# EAGLE schematic ChessMechPCB2 (EAGLE 9.6.2)
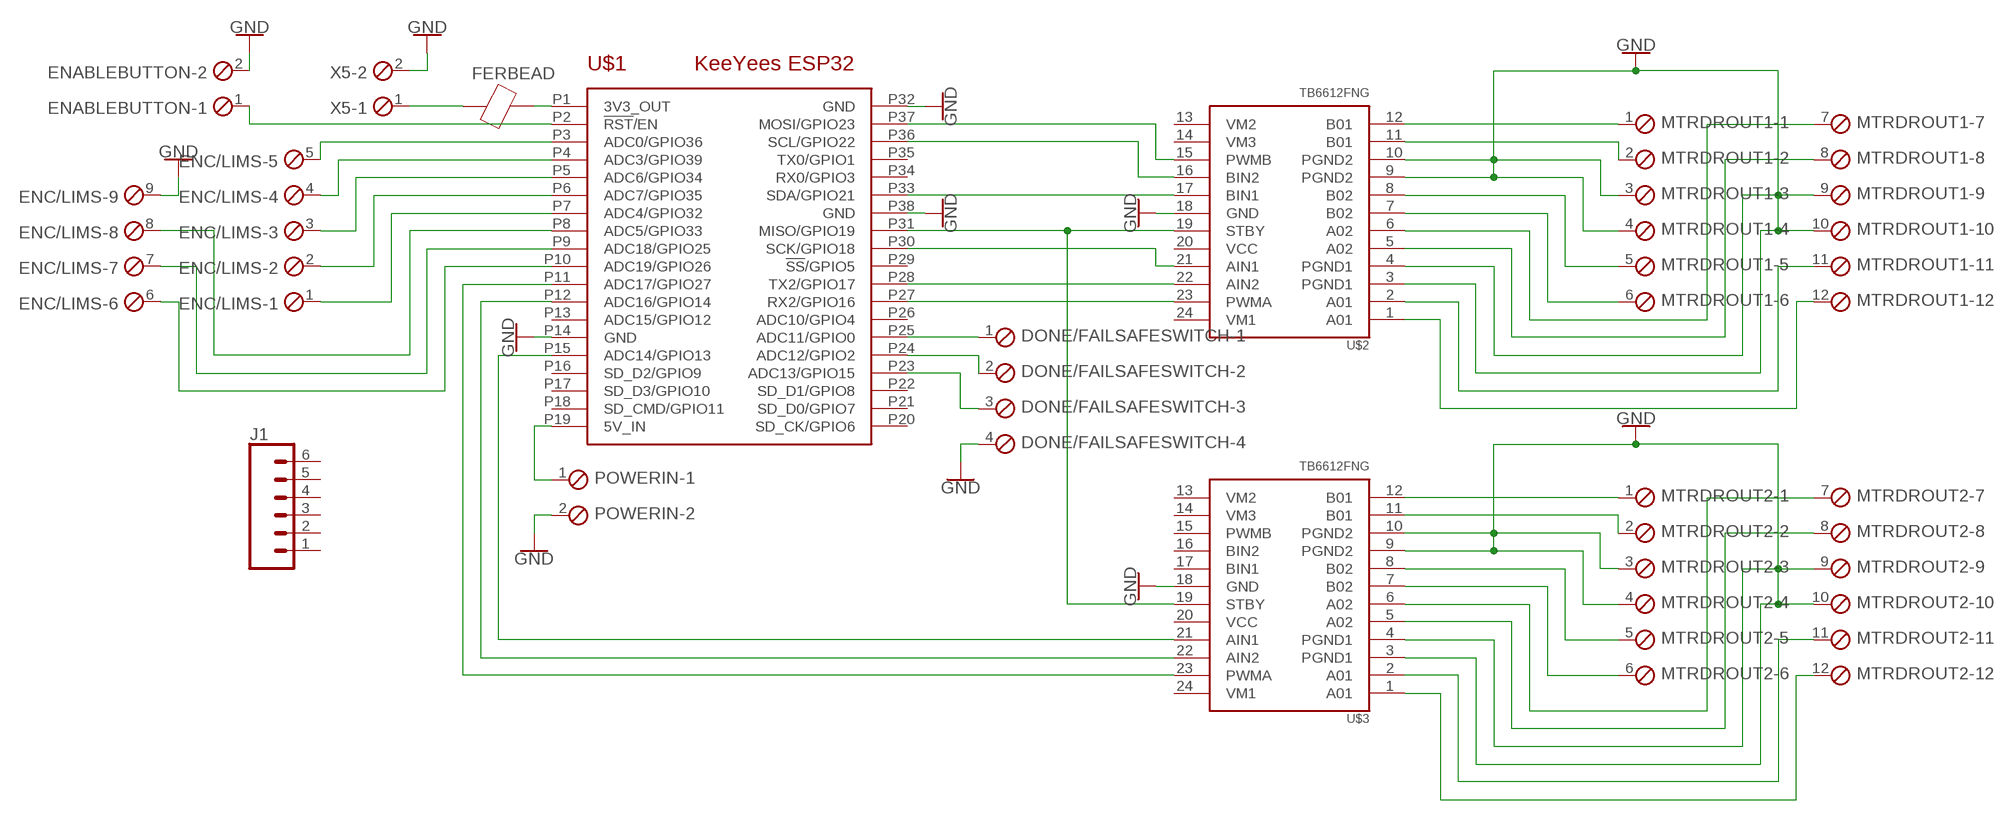
[diagram p0: schematic, sheet 1]

## Parts
DONE/FAILSAFESWITCH  SCREWTERM_4P_254  [4POL254]
ENABLEBUTTON  SCREWTERM_2P_254  [2POL254]
ENC/LIMS  SCREWTERM_9P_254  [9POL254]
FERBEAD  BEAD0402  [0402]
J1  CONN_06SILK_FEMALE_PTH  [1X06]
MTRDROUT1  SCREWTERM_12P_254  [12POL254]
MTRDROUT2  SCREWTERM_12P_254  [12POL254]
POWERIN  SCREWTERM_2P_254  [2POL254]
U$1  KEEYEES_ESP32  [KEEYEES_ESP32]
U$2  TB6612FNG  [SSOP24]
U$3  TB6612FNG  [SSOP24]
X5  SCREWTERM_2P_254  [2POL254]

## Nets
GND: DONE/FAILSAFESWITCH.4 ENABLEBUTTON.2 ENC/LIMS.9 MTRDROUT1.3 MTRDROUT1.4 MTRDROUT1.9 MTRDROUT1.10 MTRDROUT2.3 MTRDROUT2.4 MTRDROUT2.9 MTRDROUT2.10 POWERIN.2 U$1.P14(GND) U$1.P32(GND) U$1.P38(GND) U$2.3(PGND1) U$2.4(PGND1) U$2.9(PGND2) U$2.10(PGND2) U$2.18(GND) U$3.3(PGND1) U$3.4(PGND1) U$3.9(PGND2) U$3.10(PGND2) U$3.18(GND) X5.2
N$1: U$1.P37(MOSI/GPIO23) U$2.15(PWMB)
N$2: U$1.P36(SCL/GPIO22) U$2.16(BIN2)
N$3: U$1.P33(SDA/GPIO21) U$2.17(BIN1)
N$4: U$1.P30(SCK/GPIO18) U$2.21(AIN1)
N$5: U$1.P28(TX2/GPIO17) U$2.22(AIN2)
N$6: U$1.P27(RX2/GPIO16) U$2.23(PWMA)
N$7: U$1.P31(MISO/GPIO19) U$2.19(STBY) U$3.19(STBY)
N$8: ENC/LIMS.6 U$1.P10(ADC19/GPIO26)
N$9: U$1.P11(ADC17/GPIO27) U$3.23(PWMA)
N$10: U$1.P12(ADC16/GPIO14) U$3.22(AIN2)
N$11: U$1.P15(ADC14/GPIO13) U$3.21(AIN1)
N$12: ENC/LIMS.5 U$1.P3(ADC0/GPIO36)
N$13: ENC/LIMS.4 U$1.P4(ADC3/GPIO39)
N$14: ENC/LIMS.3 U$1.P5(ADC6/GPIO34)
N$15: ENC/LIMS.2 U$1.P6(ADC7/GPIO35)
N$16: ENC/LIMS.1 U$1.P7(ADC4/GPIO32)
N$17: ENC/LIMS.7 U$1.P9(ADC18/GPIO25)
N$18: ENC/LIMS.8 U$1.P8(ADC5/GPIO33)
N$19: MTRDROUT2.8 U$3.5(A02)
N$20: FERBEAD.2 U$1.P1(3V3_OUT)
N$21: MTRDROUT2.1 U$3.12(B01)
N$22: MTRDROUT2.2 U$3.11(B01)
N$23: FERBEAD.1 X5.1
N$24: POWERIN.1 U$1.P19(5V_IN)
N$25: MTRDROUT2.5 U$3.8(B02)
N$26: MTRDROUT2.6 U$3.7(B02)
N$27: MTRDROUT2.7 U$3.6(A02)
N$28: ENABLEBUTTON.1 U$1.P2(!RST!/EN)
N$29: DONE/FAILSAFESWITCH.1 U$1.P25(ADC11/GPIO0)
N$30: MTRDROUT1.1 U$2.12(B01)
N$31: MTRDROUT2.11 U$3.2(A01)
N$32: MTRDROUT2.12 U$3.1(A01)
N$33: MTRDROUT1.2 U$2.11(B01)
N$34: DONE/FAILSAFESWITCH.2 U$1.P24(ADC12/GPIO2)
N$35: DONE/FAILSAFESWITCH.3 U$1.P23(ADC13/GPIO15)
N$36: MTRDROUT1.5 U$2.8(B02)
N$37: MTRDROUT1.6 U$2.7(B02)
N$38: MTRDROUT1.7 U$2.6(A02)
N$39: MTRDROUT1.8 U$2.5(A02)
N$42: MTRDROUT1.11 U$2.2(A01)
N$43: MTRDROUT1.12 U$2.1(A01)
Unconnected: J1.1 J1.2 J1.3 J1.4 J1.5 J1.6 U$1.P13(ADC15/GPIO12) U$1.P16(SD_D2/GPIO9) U$1.P17(SD_D3/GPIO10) U$1.P18(SD_CMD/GPIO11) U$1.P20(SD_CK/GPIO6) U$1.P21(SD_D0/GPIO7) U$1.P22(SD_D1/GPIO8) U$1.P26(ADC10/GPIO4) U$1.P29(!SS!/GPIO5) U$1.P34(RX0/GPIO3) U$1.P35(TX0/GPIO1) U$2.13(VM2) U$2.14(VM3) U$2.20(VCC) U$2.24(VM1) U$3.13(VM2) U$3.14(VM3) U$3.15(PWMB) U$3.16(BIN2) U$3.17(BIN1) U$3.20(VCC) U$3.24(VM1)

## Library data of the parts
DONE/FAILSAFESWITCH = ME507:SCREWTERM_4P: Screw Terminal Block This part is designed for a screw terminal connector. The 2.54mm (0.100 inch) foorprint can also be used for male or female pin headers such as those on most development boards. One can also solder wires directly into the holes, though this makes modifications or repairs to the system more inconvenient. Larger versions can carry more current.
ENABLEBUTTON POWERIN X5 = ME507:SCREWTERM_2P: Screw Terminal Block This part is designed for a screw terminal connector. The 2.54mm (0.100 inch) foorprint can also be used for male or female pin headers such as those on most development boards. One can also solder wires directly into the holes, though this makes modifications or repairs to the system more inconvenient. Larger versions can carry more current.
ENC/LIMS = ME507:SCREWTERM_9P: Screw Terminal Block This part is designed for a screw terminal connector. The 2.54mm (0.100 inch) foorprint can also be used for male or female pin headers such as those on most development boards. One can also solder wires directly into the holes, though this makes modifications or repairs to the system more inconvenient. Larger versions can carry more current.
FERBEAD = ME507:BEAD: Ferrite Bead
J1 = SparkFun-Connectors:CONN_06: Multi connection point. Often used as Generic Header-pin footprint for 0.1 inch spaced/style header connections On any of the 0.1 inch spaced packages, you can populate with these: Break Away Headers - Straight <https://www.sparkfun.com/products/116> (PRT-00116) Break Away Male Headers - Right Angle <https://www.sparkfun.com/products/553> (PRT-00553) Female Headers <https://www.sparkfun.com/products/115> (PRT-00115) Break Away Headers - Machine Pin <https://www.sparkfun.com/products/117> (PRT-00117) Break Away Female Headers - Swiss Machine Pin <https://www.sparkfun.com/products/743> (PRT-00743) Arduino Stackable Header - 6 Pin <https://www.sparkfun.com/products/9280> (PRT-09280) For SCREWTERMINALS and SPRING TERMINALS visit here: Screw Terimnals on SparkFun.com <https://www.sparkfun.com/search/results?term=Screw+Terminals> (5mm/3.5mm/2.54mm spacing) This device is also useful as a general connection point to wire up your design to another part of your project. Our various solder wires solder well into these plated through hole pads. Hook-Up Wire - Assortment (Stranded, 22 AWG) <https://www.sparkfun.com/products/11375> (PRT-11375) Hook-Up Wire - Assortment (Solid Core, 22 AWG) <https://www.sparkfun.com/products/11367> (PRT-11367) View the entire wire category on our website here <https://www.sparkfun.com/categories/141>; PROD_ID: CONN-08437
MTRDROUT1 MTRDROUT2 = ME507:SCREWTERM_12P: Screw Terminal Block This part is designed for a screw terminal connector. The 2.54mm (0.100 inch) foorprint can also be used for male or female pin headers such as those on most development boards. One can also solder wires directly into the holes, though this makes modifications or repairs to the system more inconvenient. Larger versions can carry more current.
U$1 = ME507:KEEYEES_ESP32: Footprint for an add-on board (shield, hat, etc.) for a KeeYees ESP32 development board with ESP-WROOM-32 module. 38 pins.
U$2 U$3 = SparkFun-IC-Special-Function:TB6612FNG: Toshiba 1A dual motor driver IC-09363; PROD_ID: IC-09363